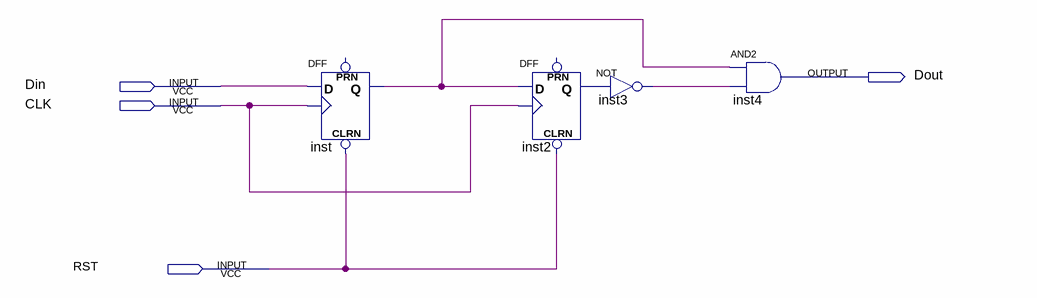
[diagram p0: schematic sheet]
// Quartus schematic eight.bdf as structural Verilog: 4 symbols, 4 pins
module eight (
  input  Din,
  input  CLK,
  input  RST,
  output Dout
);

  wire inst2_q, inst3_out, inst_q;

  DFF inst (.CLRN(RST), .CLK(CLK), .D(Din), .Q(inst_q));  // open: PRN
  DFF inst2 (.CLRN(RST), .CLK(CLK), .D(inst_q), .Q(inst2_q));  // open: PRN
  not inst3 (inst3_out, inst2_q);
  and inst4 (Dout, inst_q, inst3_out);
endmodule
